# Altium schematic sheet SCC1002_MICROCONTROLLER.SchDoc
size A4; DrawnBy: Marco; Organization: HomeAuto; ProjectName: SCC1002
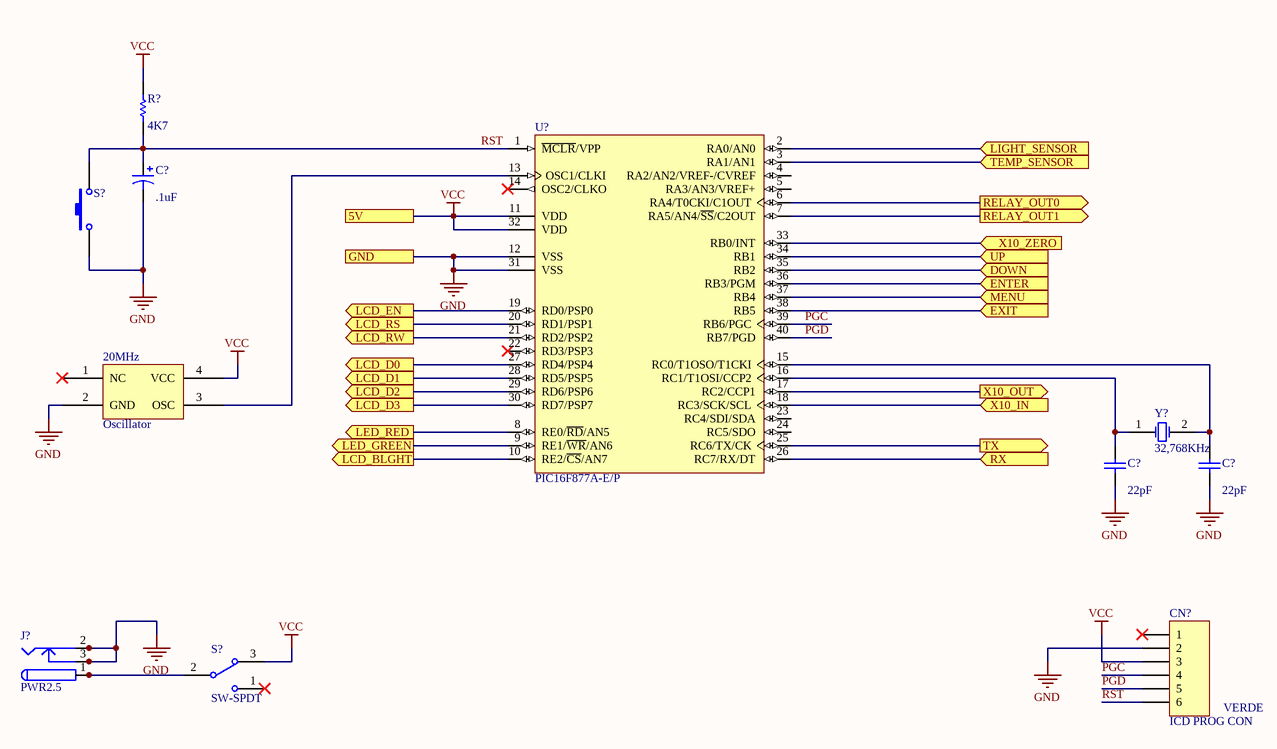
[diagram p0: SCC1002_MICROCONTROLLER.SchDoc]

## Parts
(Parts that share a designator on the sheet are numbered #1, #2 ... from top to bottom, then left to right.)
20MHz  Oscillator
C?#1  value .1uF  [RB7.6-15]  (hidden comment: Cap Pol1)
C?#2  value 22pF  [RAD-0.3]  (hidden comment: Cap)
C?#3  value 22pF  [RAD-0.3]  (hidden comment: Cap)
CN?  ICD PROG CON  [HDR1X6]
J?  PWR2.5  [KLD-0202]
R?  value 4K7  [AXIAL-0.3]  (hidden comment: Res1)
S?#1  SW-PB  [SPST-2]  (value not drawn)
S?#2  SW-SPDT  [TL36WW15050]
U?  PIC16F877A-E/P  [PDIP600-P40]
Y?  32,768KHz  [R38]

## Ports
5V, DOWN (in), ENTER (in), EXIT (in), GND, LCD_BLGHT (out), LCD_D0 (out), LCD_D1 (out), LCD_D2 (out), LCD_D3 (out), LCD_EN (out), LCD_RS (out), LCD_RW (out), LED_GREEN (out), LED_RED (out), LIGHT_SENSOR (in), MENU (in), RELAY_OUT0 (out), RELAY_OUT1 (out), RX (in), TEMP_SENSOR (in), TX (out), UP (in), X10_IN (in), X10_OUT (out), X10_ZERO (in)

## Nets
GND: 20MHz.2(GND) C?#1.2 C?#2.1 C?#3.1 CN?.2 J?.2 J?.2A J?.2B J?.3 J?.3A J?.3B S?#1.1 U?.12(VSS) U?.31(VSS) ; port GND
VCC: 20MHz.4(VCC) CN?.3 R?.2 S?#2.3 U?.11(VDD) U?.32(VDD) ; port 5V
DOWN: U?.35(RB2) ; port DOWN
ENTER: U?.36(RB3/PGM) ; port ENTER
EXIT: U?.38(RB5) ; port EXIT
LCD_BLGHT: U?.10(RE2/~{CS}/AN7) ; port LCD_BLGHT
LCD_D0: U?.27(RD4/PSP4) ; port LCD_D0
LCD_D1: U?.28(RD5/PSP5) ; port LCD_D1
LCD_D2: U?.29(RD6/PSP6) ; port LCD_D2
LCD_D3: U?.30(RD7/PSP7) ; port LCD_D3
LCD_EN: U?.19(RD0/PSP0) ; port LCD_EN
LCD_RS: U?.20(RD1/PSP1) ; port LCD_RS
LCD_RW: U?.21(RD2/PSP2) ; port LCD_RW
LED_GREEN: U?.9(RE1/~{WR}/AN6) ; port LED_GREEN
LED_RED: U?.8(RE0/~{RD}/AN5) ; port LED_RED
LIGHT_SENSOR: U?.2(RA0/AN0) ; port LIGHT_SENSOR
MENU: U?.37(RB4) ; port MENU
PGC: CN?.4 U?.39(RB6/PGC)
PGD: CN?.5 U?.40(RB7/PGD)
RELAY_OUT0: U?.6(RA4/T0CKI/C1OUT) ; port RELAY_OUT0
RELAY_OUT1: U?.7(RA5/AN4/~{SS}/C2OUT) ; port RELAY_OUT1
RST: C?#1.1 CN?.6 R?.1 S?#1.2 U?.1(~{MCLR}/VPP)
RX: U?.26(RC7/RX/DT) ; port RX
TEMP_SENSOR: U?.3(RA1/AN1) ; port TEMP_SENSOR
TX: U?.25(RC6/TX/CK) ; port TX
UP: U?.34(RB1) ; port UP
X10_IN: U?.18(RC3/SCK/SCL) ; port X10_IN
X10_OUT: U?.17(RC2/CCP1) ; port X10_OUT
X10_ZERO: U?.33(RB0/INT) ; port X10_ZERO
Net20MHz_3: 20MHz.3(OSC) U?.13(OSC1/CLKI)
NetC?#2_2: C?#2.2 U?.16(RC1/T1OSI/CCP2) Y?.1(OSC1)
NetC?#3_2: C?#3.2 U?.15(RC0/T1OSO/T1CKI) Y?.2(OSC2)
NetJ?_1: J?.1 J?.1A J?.1B S?#2.2

Not connected (* = marked no-connect by the designer): 20MHz 1(NC)*; CN? 1*; S?#2 1*; U? 4(RA2/AN2/VREF-/CVREF) 5(RA3/AN3/VREF+) 14(OSC2/CLKO)* 22(RD3/PSP3)* 23(RC4/SDI/SDA) 24(RC5/SDO)

## Notes on the sheet
- VERDE

## Library data of the parts
20MHz = Oscilator: Integrated oscillator
C?#1 = Cap Pol1: Polarized Capacitor (Radial); Published: 8-Jun-2000; LatestRevisionDate: 17-Jul-2002; LatestRevisionNote: Re-released for DXP Platform.; PackageReference: RB7.6-15; Publisher: Altium Limited; PackageDescription: Polarized Capacitor (Radial); 2 Leads
C?#2 C?#3 = Cap: Capacitor; Published: 8-Jun-2000; LatestRevisionDate: 17-Jul-2002; LatestRevisionNote: Re-released for DXP Platform.; PackageReference: RAD-0.3; Publisher: Altium Limited; PackageDescription: Radial Cap, Thru-Hole; 2 Leads; 0.3 in Pin Spacing
CN? = Header 6: Header, 6-Pin; LatestRevisionDate: 17-Jul-2002; LatestRevisionNote: Re-released for DXP Platform.; Publisher: Altium Limited
J? = PWR2.5: Low Voltage Power Supply Connector; Published: 17-Dec-2003; DatasheetDocument: 09-May-2002; Publisher: Altium Limited; ComponentLink1Description: Manufacturer Link; ComponentLink1URL: http://domino.kycon.com/internet/Products.html
R? = Res1: Resistor; Published: 8-Jun-2000; LatestRevisionDate: 17-Jul-2002; LatestRevisionNote: Re-released for DXP Platform.; PackageReference: AXIAL-0.3; Publisher: Altium Limited; PackageDescription: Axial Device, Thru-Hole; 2 Leads; 0.3 in Pin Spacing
S?#1 = SW-PB: Switch; Published: 24-Mar-1999; LatestRevisionDate: 17-Jul-2002; LatestRevisionNote: Re-released for DXP Platform.; PackageReference: SPST-2; Publisher: Altium Limited; PackageDescription: Switch; 2 Leads
S?#2 = SW-SPDT: SPDT Subminiature Toggle Switch, Right Angle Mounting, Vertical Actuation; Published: 24-Mar-1999; LatestRevisionDate: 17-Dec-2003; LatestRevisionNote: Schematic revised, PCB Footprint replaced.; DatasheetVersion: 05-Dec-2000; PackageReference: TL36WW15050; Publisher: Altium Limited; PackageDescription: Switch; 4 Leads; ComponentLink1Description: Manufacturer Link; ComponentLink1URL: http://www.apem.com
U? = PIC16F877A-E/P: Enhanced FLASH Microcontroller, 8K (x14-Bit words) FLASH, 368 Bytes RAM, 40-Pin PDIP, Standard VDD Range, Extended Temperature; ComponentAvailability: Unknown. Contact manufacturer to determine status.; Published: 11-Oct-2004; LatestRevisionDate: 29-Jan-2009; LatestRevisionNote: Sch. layout revised. 3D Model Removed.; DatasheetVersion: revB, Oct-2003; PackageVersion: revBB, Aug-2009; PackageReference: PDIP600-P40; Publisher: Altium Limited; PackageDescription: 40-Lead Plastic Dual In-Line (P) - 600 mil Body [PDIP]; Supplier 1: Digi-Key; Supplier Part Number 1: PIC16F877A-E/P-ND; Supplier 2: Farnell; Supplier Part Number 2: 1567990; ComponentLink1Description: Datasheet; ComponentLink1URL: http://ww1.microchip.com/downloads/en/DeviceDoc/39582b.pdf; ComponentLink2Description: Packaging Specification; ComponentLink2URL: http://www.microchip.com/stellent/groups/techpub_sg/documents/packagingspec/en012702.pdf; ComponentLink3Description: Microchip.com Home; ComponentLink3URL: http://www.microchip.com/
Y? = XTAL: Crystal Oscillator; Published: 8-Jun-2000; LatestRevisionDate: 17-Jul-2002; LatestRevisionNote: Re-released for DXP Platform.; PackageReference: R38; Publisher: Altium Limited; PackageDescription: Crystal, Thru-Hole; 2 Leads; Body 3.1 x 8.2 mm (Dia.xH)